# Altium schematic sheet MICRO AND VREF.SchDoc
size A4
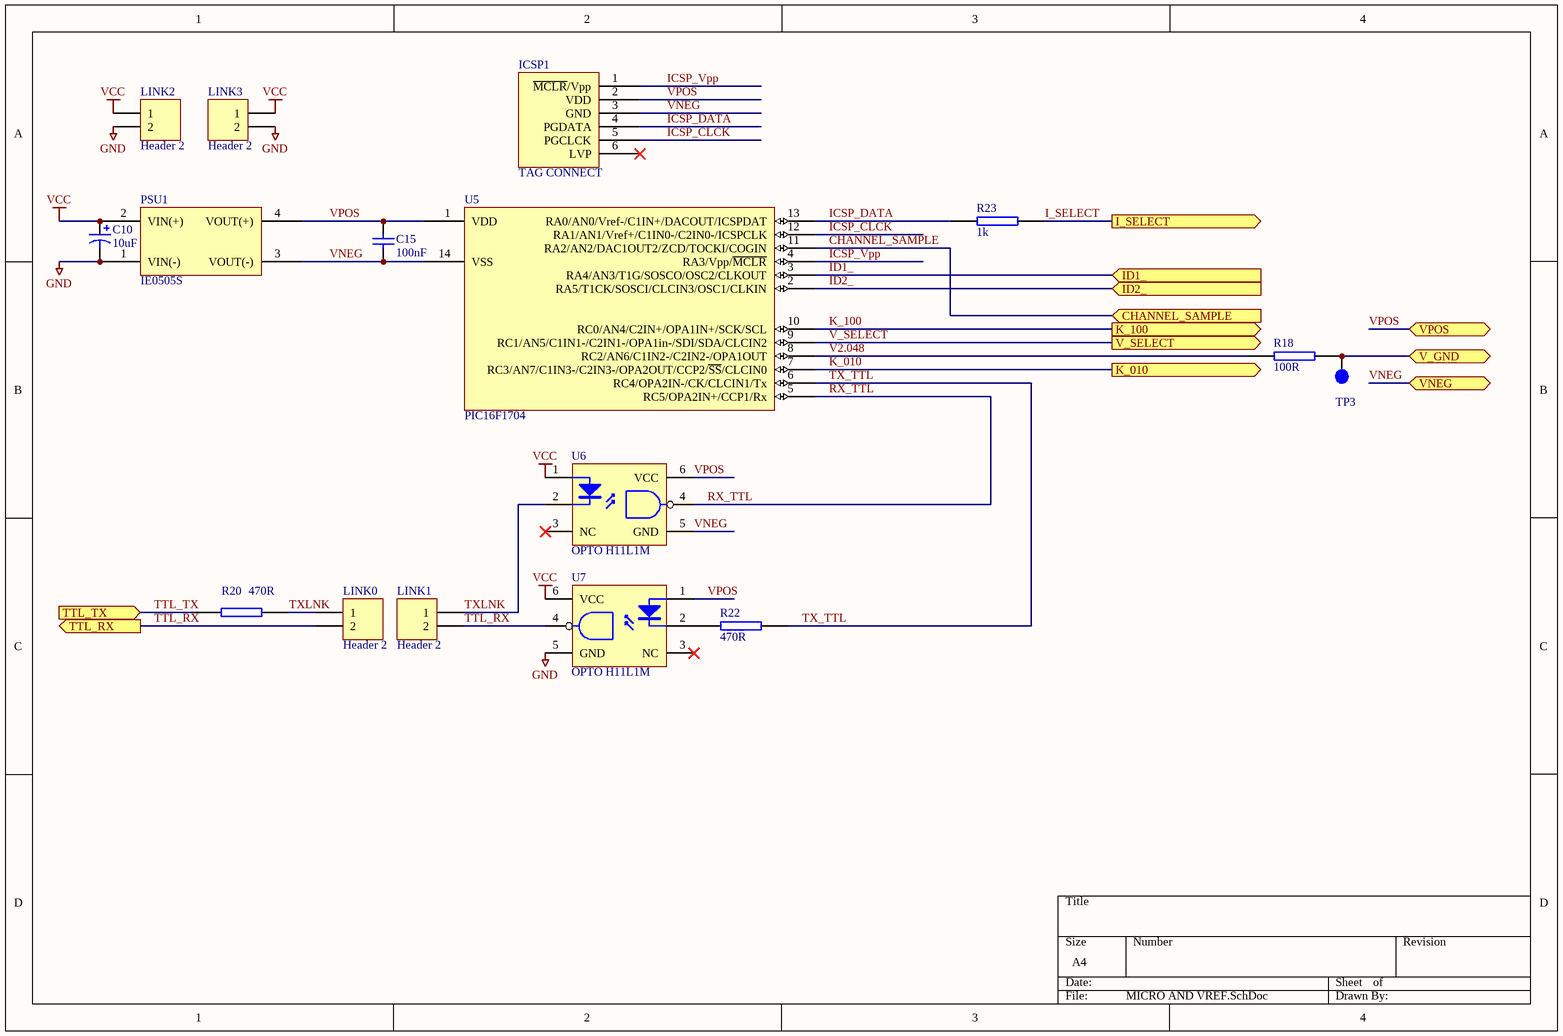
[diagram p0: MICRO AND VREF.SchDoc]

## Parts
C10  10uF  [CAP ELECTRO SIZE-B]
C15  100nF  [CAP (3D) - 0603]
ICSP1  TAG CONNECT  [ICSP - TAG CONNECT TYPE2]
LINK0  Header 2  [HDR1X2]
LINK1  Header 2  [HDR1X2]
LINK2  Header 2  [HDR1X2]
LINK3  Header 2  [HDR1X2]
PSU1  IE0505S  [IE0505S]
R18  100R  [RES (3D) - 0603]
R20  470R  [RES (3D) - 0603]
R22  470R  [RES (3D) - 0603]
R23  1k  [RES (3D) - 0603]
TP3  TestPoint  [TP]  (value not drawn)
U5  PIC16F1704  [SOIC-14]
U6  OPTO H11L1M  [DIP_6]
U7  OPTO H11L1M  [DIP_6]

## Ports
CHANNEL_SAMPLE (in), I_SELECT (out), ID1_ (in), ID2_ (in), K_010 (out), K_100 (out), TTL_RX, TTL_TX (in), V_GND (bidir), V_SELECT (out), VNEG, VPOS

## Nets
GND: C10.2 LINK2.2 LINK3.2 PSU1.1(VIN(-)) U7.5(GND)
VCC: C10.1 LINK2.1 LINK3.1 PSU1.2(VIN(+)) U6.1(A) U7.6(VCC)
CHANNEL_SAMPLE: U5.11(RA2/AN2/DAC1OUT2/ZCD/TOCKI/COGIN) ; port CHANNEL_SAMPLE
I_SELECT: R23.2 ; port I_SELECT
ICSP_CLCK: ICSP1.5(PGCLCK) U5.12(RA1/AN1/Vref+/C1IN0-/C2IN0-/ICSPCLK)
ICSP_DATA: ICSP1.4(PGDATA) R23.1 U5.13(RA0/AN0/Vref-/C1IN+/DACOUT/ICSPDAT)
ICSP_Vpp: ICSP1.1(~{MCLR}/Vpp) U5.4(RA3/Vpp/~{MCLR})
ID1_: U5.3(RA4/AN3/T1G/SOSCO/OSC2/CLKOUT) ; port ID1_
ID2_: U5.2(RA5/T1CK/SOSCI/CLCIN3/OSC1/CLKIN) ; port ID2_
K_010: U5.7(RC3/AN7/C1IN3-/C2IN3-/OPA2OUT/CCP2/~{SS}/CLCIN0) ; port K_010
K_100: U5.10(RC0/AN4/C2IN+/OPA1IN+/SCK/SCL) ; port K_100
RX_TTL: U5.5(RC5/OPA2IN+/CCP1/Rx) U6.4(Q)
TTL_RX: LINK0.2 LINK1.2 U7.4(Q) ; port TTL_RX
TTL_TX: R20.1 ; port TTL_TX
TX_TTL: R22.2 U5.6(RC4/OPA2IN-/CK/CLCIN1/Tx)
TXLNK: LINK0.1 LINK1.1 R20.2 U6.2(K)
V2.048: R18.1 U5.8(RC2/AN6/C1IN2-/C2IN2-/OPA1OUT)
V_GND: R18.2 TP3.1 ; port V_GND
V_SELECT: U5.9(RC1/AN5/C1IN1-/C2IN1-/OPA1in-/SDI/SDA/CLCIN2) ; port V_SELECT
VNEG: C15.1 ICSP1.3(GND) PSU1.3(VOUT(-)) U5.14(VSS) U6.5(GND) ; port VNEG
VPOS: C15.2 ICSP1.2(VDD) PSU1.4(VOUT(+)) U5.1(VDD) U6.6(VCC) U7.1(A) ; port VPOS
NetR22_1: R22.1 U7.2(K)

Not connected (* = marked no-connect by the designer): ICSP1 6(LVP)*; U6 3(NC)*; U7 3(NC)*

## Library data of the parts
C10 = Cap Pol1: Polarized Capacitor (Radial); Value: 10uF
C15 = Cap: Capacitor; Value: 100nF; Supplier 1: Mouser; Supplier 2: Digi-Key; Supplier Part Number 1: 603-C0603ZRY5V9BB104; Supplier Part Number 2: 311-1343-2-ND
ICSP1 = ICSP - TAG CONNECT: Manufacturer: N/A - PCB ARTWORK; Manufacturer Part No.: N/A; Mouser Part no.: N/A; Web link: N/A - PCB ARTWORK
LINK0-LINK3 = Header 2: Header, 2-Pin; LatestRevisionDate: 17-Jul-2002; LatestRevisionNote: Re-released for DXP Platform.; Publisher: Altium Limited
PSU1 = 5V ISOLATED: XP POWER IE0505S; Farnell Part no.: 8727694; Manufacturer: XP POWER; value: IE0505S; Web link: http://au.element14.com/jsp/displayProduct.jsp?sku=8727694&CMP=KNC-GOO-SKU-OTH&mckv=sbz05Gxuo|pcrid|11128913208|pkw|ie0505s|pmt|p&s_kwcid=TC|15109|ie0505s|S|p|11128913208
R18 R23 = RES SMD 0603: RESISTOR SMD 0603
  R18: value: 100R
  R23: value: 1k
R20 R22 = RES SMD 0603 1k: RESISTOR SMD 0603 1k; value: 470R
U6 U7 = H11L1M: 6-Pin Logic Output Optocoupler
U5 = PIC16F1704: Web Link: http://au.mouser.com/ProductDetail/Microchip-Technology/PIC16F1823-I-SL/?qs=sGAEpiMZZMvqv2n3s2xjsW2MXUmlRZqtARQgJEn43Ss%3d